# Altium schematic sheet [6]_Debug.SchDoc
size A3; DocumentNumber: 6; SheetNumber: 6; SheetTotal: 9; PageSetup: Record=PageOptions|CenterHorizontal=True|CenterVertical=True|PrintScale=0.97|XCorrection=1.00|YCorrection=1.00|PrintKind=1|BorderSize=5000000|LeftOffset=0|BottomOffset=0|Orientation=2|PaperLength=2970|PaperWidth=2100|Scale=100|PaperSource=7|PrintQuality=600|MediaType=1|DitherType=10|PaperKind=A4|PrintScaleMode=1
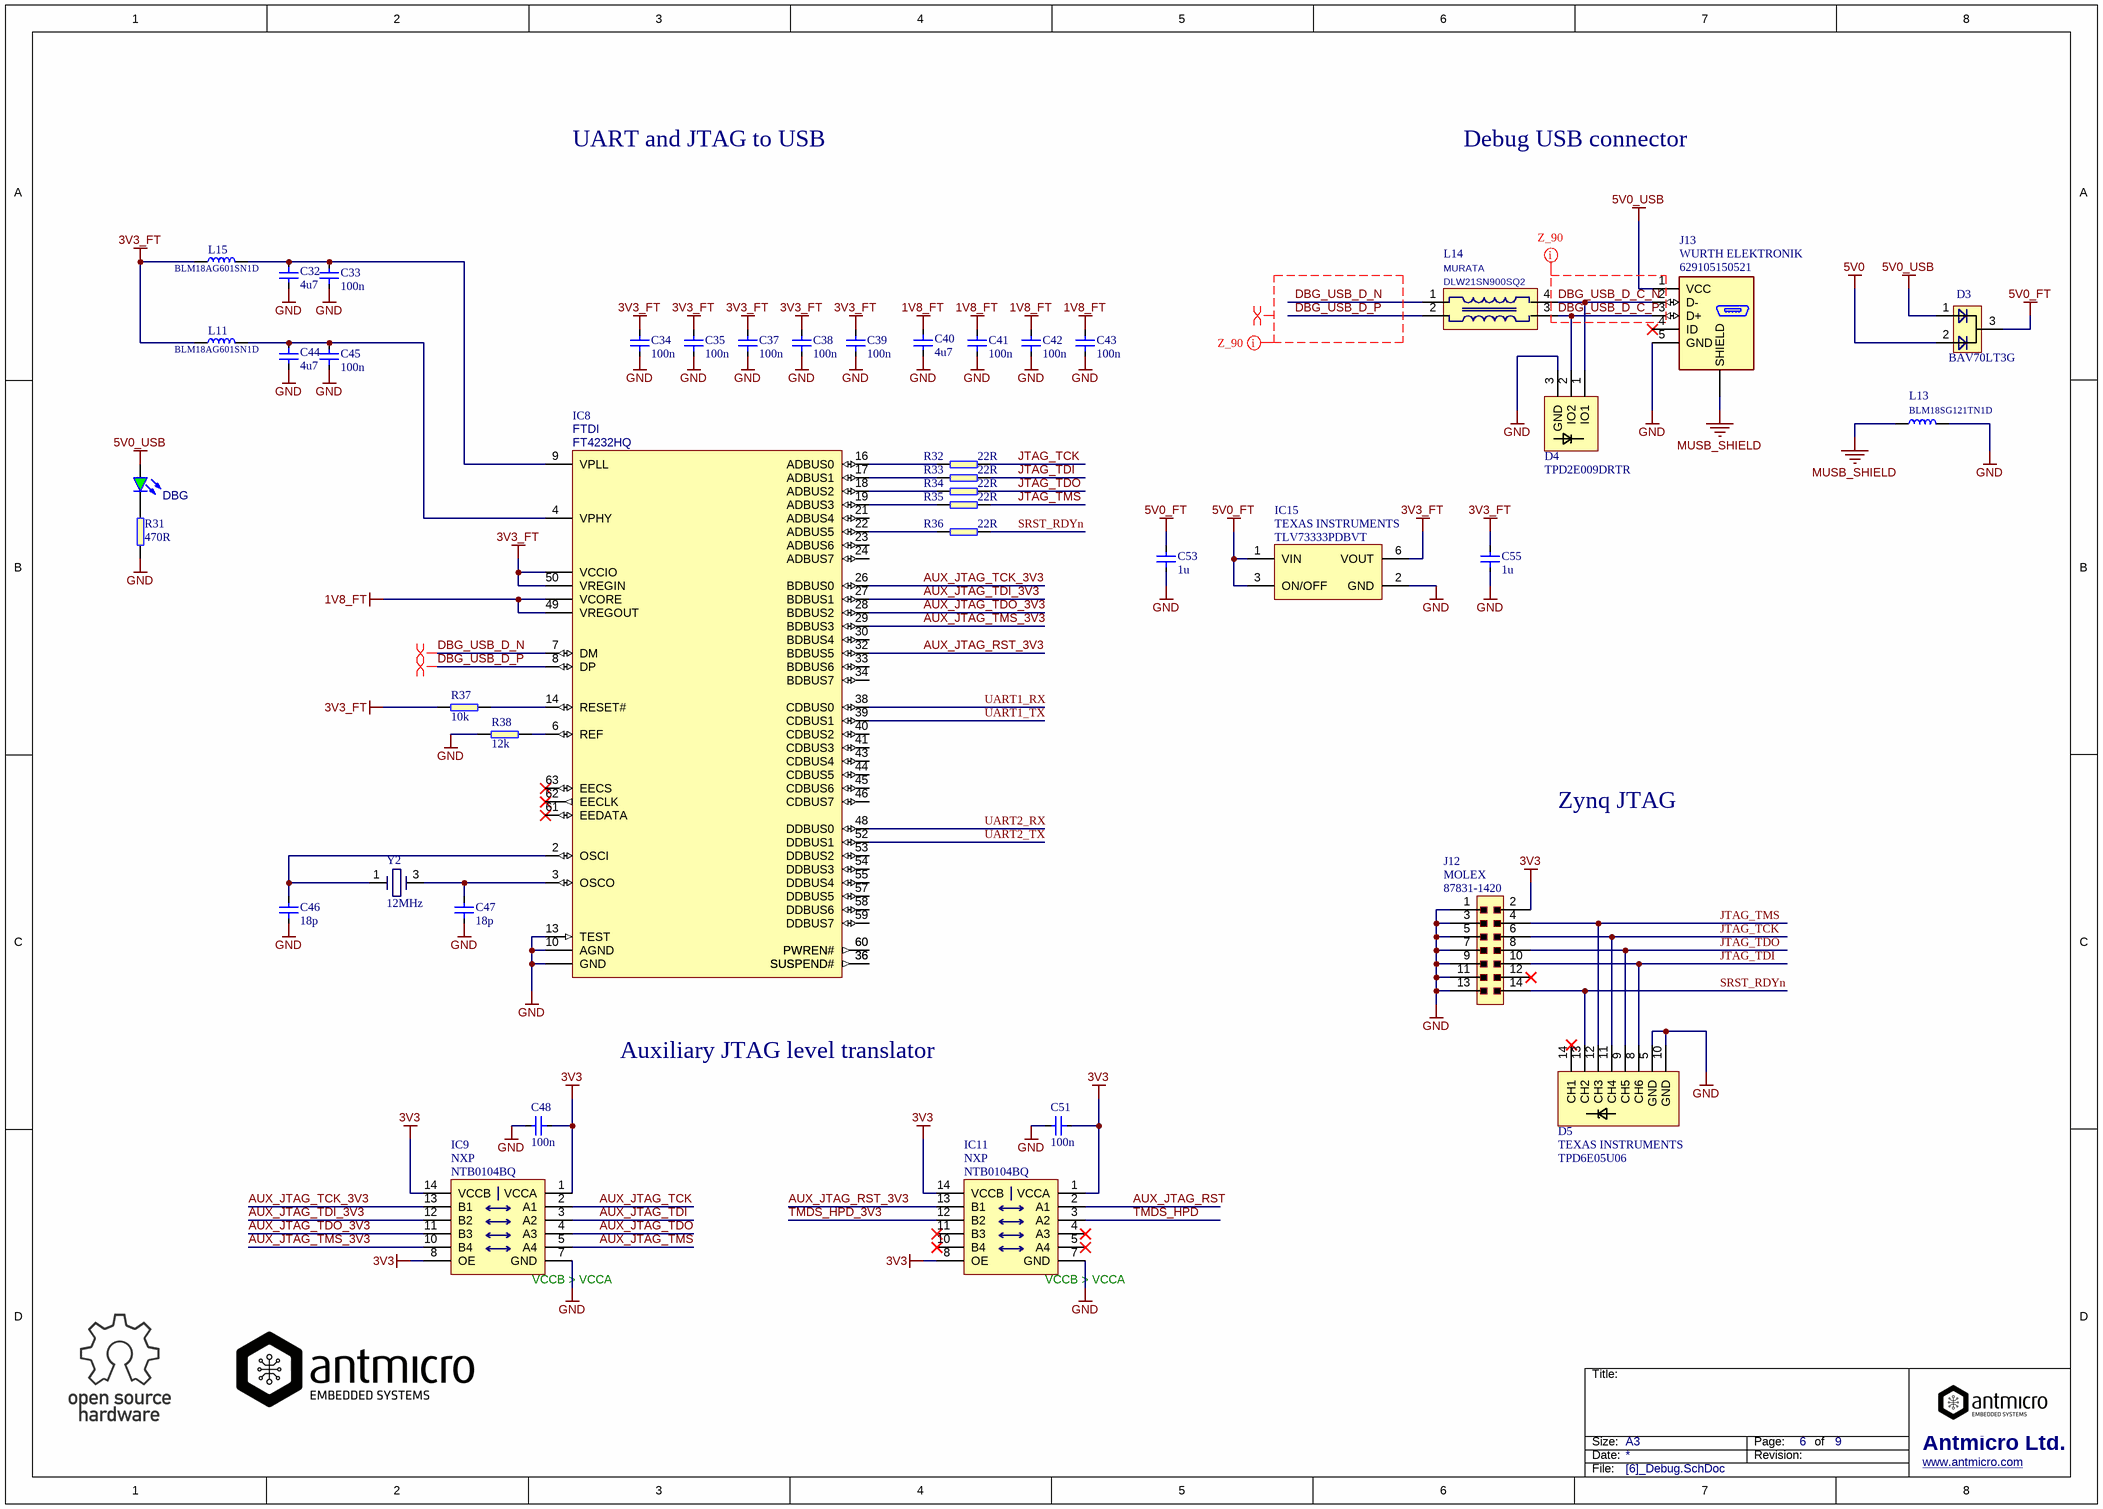
[diagram p0: [6]_Debug.SchDoc]

## Parts
C32  4u7  [0603]
C33  100n  [0402]
C34  100n  [0402]
C35  100n  [0402]
C37  100n  [0402]
C38  100n  [0402]
C39  100n  [0402]
C40  4u7  [0603]
C41  100n  [0402]
C42  100n  [0402]
C43  100n  [0402]
C44  4u7  [0603]
C45  100n  [0402]
C46  18p  [0402]
C47  18p  [0402]
C48  100n  [0402]
C51  100n  [0402]
C53  1u  [0603]
C55  1u  [0603]
D3  BAV70LT3G  [SOT-23]
D4  TPD2E009DRTR  [SOT-3]
D5  Manufacturer: TEXAS INSTRUMENTS  [TPD6E05U06_PASS]  (hidden comment: TPD6E05U06)
DBG  KPT-1608SGC  [LED0603]  (value not drawn)
IC8  Manufacturer: FTDI  [FT2232HQ]  (hidden comment: FT4232HQ)
IC9  Manufacturer: NXP  [DHVQFN14]  (hidden comment: NTB0104BQ)
IC11  Manufacturer: NXP  [DHVQFN14]  (hidden comment: NTB0104BQ)
IC15  TLV73333PDBVT  Manufacturer: TEXAS INSTRUMENTS  [SOT23-5N]
J12  Manufacturer: MOLEX  Part Symbol: 87831-1420  [CON-Molex-87831-1420]  (hidden comment: Molex-87831-1420)
J13  Manufacturer: WURTH ELEKTRONIK  Part Symbol: 629105150521  [WE_629105150521]
L11  BLM18AG601SN1D  [0603]
L13  BLM18SG121TN1D  [0603]
L14  Manufacturer: MURATA  [DLW21SN900SQ2]  (hidden comment: DLW21SN900SQ2)
L15  BLM18AG601SN1D  [0603]
R31  470R  [0402]
R32  22R  [0402]
R33  22R  [0402]
R34  22R  [0402]
R35  22R  [0402]
R36  22R  [0402]
R37  10k  [0402]
R38  12k  [0402]
Y2  12MHz  [QC3CA12]

## Nets
1V8_FT: C40.1 C41.2 C42.2 C43.2 IC8.49(VREGOUT) IC8.VCORE
3V3: C48.1 C51.1 IC9.1(VCCA) IC9.8(OE) IC9.14(VCCB) IC11.1(VCCA) IC11.8(OE) IC11.14(VCCB) J12.2
3V3_FT: C34.2 C35.2 C37.2 C38.2 C39.2 C55.2 IC8.50(VREGIN) IC8.VCCIO IC15.6(VOUT) L11.1 L15.1 R37.1
5V0: D3.2
5V0_FT: C53.2 D3.3 IC15.1(VIN) IC15.3(ON/OFF)
5V0_USB: D3.1 DBG.A J13.1(VCC)
GND: C32.2 C33.1 C34.1 C35.1 C37.1 C38.1 C39.1 C40.2 C41.1 C42.1 C43.1 C44.2 C45.1 C46.1 C47.1 C48.2 C51.2 C53.1 C55.1 D4.3(GND) D5.5(GND) D5.10(GND) IC8.10(AGND) IC8.13(TEST) IC8.GND IC9.7(GND) IC11.7(GND) IC15.2(GND) J12.1 J12.3 J12.5 J12.7 J12.9 J12.11 J12.13 J13.5(GND) L13.2 R31.1 R38.1 Y2.2 Y2.4
MUSB_SHIELD: J13.S(SHIELD) L13.1
AUX_JTAG_RST: IC11.2(A1)
AUX_JTAG_RST_3V3: IC8.32(BDBUS5) IC11.13(B1)
AUX_JTAG_TCK: IC9.2(A1)
AUX_JTAG_TCK_3V3: IC8.26(BDBUS0) IC9.13(B1)
AUX_JTAG_TDI: IC9.3(A2)
AUX_JTAG_TDI_3V3: IC8.27(BDBUS1) IC9.12(B2)
AUX_JTAG_TDO: IC9.4(A3)
AUX_JTAG_TDO_3V3: IC8.28(BDBUS2) IC9.11(B3)
AUX_JTAG_TMS: IC9.5(A4)
AUX_JTAG_TMS_3V3: IC8.29(BDBUS3) IC9.10(B4)
DBG_USB_D_C_N: D4.1(IO1) J13.2(D-) L14.4
DBG_USB_D_C_P: D4.2(IO2) J13.3(D+) L14.3
DBG_USB_D_N: IC8.7(DM) L14.1
DBG_USB_D_P: IC8.8(DP) L14.2
JTAG_TCK: D5.11(CH4) J12.6 R32.2
JTAG_TDI: D5.8(CH6) J12.10 R33.2
JTAG_TDO: D5.9(CH5) J12.8 R34.2
JTAG_TMS: D5.12(CH3) J12.4 R35.2
SRST_RDYn: D5.13(CH2) J12.14 R36.2
TMDS_HPD: IC11.3(A2)
TMDS_HPD_3V3: IC11.12(B2)
UART1_RX: IC8.38(CDBUS0)
UART1_TX: IC8.39(CDBUS1)
UART2_RX: IC8.48(DDBUS0)
UART2_TX: IC8.52(DDBUS1)
NetC32_1: C32.1 C33.2 IC8.9(VPLL) L15.2
NetC44_1: C44.1 C45.2 IC8.4(VPHY) L11.2
NetC46_2: C46.2 IC8.2(OSCI) Y2.1
NetC47_2: C47.2 IC8.3(OSCO) Y2.3
NetDBG_K: DBG.K R31.2
NetIC8_6: IC8.6(REF) R38.2
NetIC8_14: IC8.14(RESET#) R37.2
NetIC8_16: IC8.16(ADBUS0) R32.1
NetIC8_17: IC8.17(ADBUS1) R33.1
NetIC8_18: IC8.18(ADBUS2) R34.1
NetIC8_19: IC8.19(ADBUS3) R35.1
NetIC8_22: IC8.22(ADBUS5) R36.1

Not connected (* = marked no-connect by the designer): D5 14(CH1)*; IC8 21(ADBUS4) 23(ADBUS6) 24(ADBUS7) 30(BDBUS4) 33(BDBUS6) 34(BDBUS7) 36(SUSPEND#) 40(CDBUS2) 41(CDBUS3) 43(CDBUS4) 44(CDBUS5) 45(CDBUS6) 46(CDBUS7) 53(DDBUS2) 54(DDBUS3) 55(DDBUS4) 57(DDBUS5) 58(DDBUS6) 59(DDBUS7) 60(PWREN#) 61(EEDATA)* 62(EECLK)* 63(EECS)*; IC11 4(A3)* 5(A4)* 10(B4)* 11(B3)*; J12 12*; J13 4(ID)*

## Layout directives
differential pair: DBG_USB_D_N, DBG_USB_D_P
net class Z_90: DBG_USB_D_C_N, DBG_USB_D_C_P, DBG_USB_D_N, DBG_USB_D_P

## Notes on the sheet
- UART and JTAG to USB
- Debug USB connector
- Zynq JTAG
- Auxiliary JTAG level translator
- (near IC9) VCCB > VCCA
- (near IC11) VCCB > VCCA
- Title:
- Size:
- Date:
- A3
- Revision:
- Page:
- of
- Antmicro Ltd.
- File:
- www.antmicro.com

## Library data of the parts
C32 C40 C44 = C_4u7_0603: MLCC SMT Capacitor 4u7 0603; Manufacturer: MULTICOMP; Part Symbol: MC0603X475K6R3CT; Voltage: 6.3V; Part Number: C_4u7_0603; Value: 4u7
C33-C35 C37-C39 C41-C43 C45 C48 C51 = C_100n_0402: MLCC SMT Capacitor 100nF 0402; Manufacturer: MULTICOMP; Part Symbol: MC0402X104M100CT; Voltage: 10V; Tolerance: +-20%; Part Number: C_100n_0402; Value: 100n
C46 C47 = C_18p_0402: MLCC SMT Capacitor 18pF 0402; Manufacturer: KEMET; Part Symbol: C0402C180J5GACAUTO; Voltage: 50V; Tolerance: +-5%; Part Number: C_18p_0402; Value: 18p
C53 C55 = C_1u_0603: MLCC SMT Capacitor 1u 0603; Manufacturer: MULTICOMP; Part Symbol: MC0603X105M6R3CT; Voltage: 6.3V; Tolerance: +-20%; Part Number: C_1u_0603; Value: 1u
D3 = BAV70LT3G: Dual switching diode, common cathode; Manufacturer: ON SEMICONDUCTOR; Value: BAV70LT3G; Part Number: BAV70LT3G; Part Symbol: BAV70LT3G
D4 = TPD2E009: ESD Suppressors 2-CH; Manufacturer: TEXAS INSTRUMENTS; Part Number: TPD2E009DRTR; Value: TPD2E009DRTR; Part Symbol: TPD2E009DRTR
D5 = TPD6E05U06: ESD Suppressors 6-CH Pass through layout; Part Symbol: TPD6E05U06RVZR; Part Number: TPD6E05U06_PASS; Value: TPD6E05U06
DBG = LED: LED Green 0603 case; Part Number: LED_G; Manufacturer: KINGBRIGHT; Value: KPT-1608SGC; Part Symbol: KPT-1608SGC
IC8 = FT4232HQ: FTDI  FT4232HQ-R  Interface Bridges, USB to UART, MPSSE, 1.62 V, 1.98 V, QFN, 64 Pins, -40 °C; Part Number: FT4232HQ; Value: FT4232HQ; Part Symbol: FT4232HQ-R
IC9 IC11 = NTB0104BQ: 4 bit voltage level translator - no pullups; Part Number: NTB0104BQ; Value: NTB0104BQ; Part Symbol: NTB0104BQ
IC15 = TLV73333PDBVT: Capacitor-Free, 300-mA, Low-Dropout Regulator with Foldback Current Limit for Portable Devices; Part Symbol: TLV73328PDBVT; Part Number: TLV73333PDBVT; Value: TLV73333PDBVT
J12 = CON-Molex-87831-1420: HEADER, SQUARE PIN, M/GRID, 14WAY; Part Number: CON-Molex-87831-1420; Value: Molex-87831-1420
J13 = Micro USB B: Part Number: WE_629105150521
L11 L15 = BLM18AG601SN1D: FERRITE BEAD, 0.38OHM, 0.5, 0603; Manufacturer: MURATA; Part Symbol: BLM18SG121TN1D; Part Number: BLM18AG601SN1D; Value: BLM18AG601SN1D
L13 = BLM18SG121TN1D: FERRITE BEAD, 0.025OHM, 3A, 0603; Manufacturer: MURATA; Part Number: BLM18SG121TN1D; Value: BLM18SG121TN1D; Part Symbol: BLM18SG121TN1D
L14 = DLW21SN900SQ2: Common mode choke; Part Symbol: DLW21SN900SQ2L; Part Number: DLW21SN900SQ2; Value: DLW21SN900SQ2
R31 = R_470R_0402: SMT Resistor 470R 0402; Manufacturer: VISHAY; Part Symbol: CRCW0402470RFKED; Tolerance: 1%; Value: 470R; Part Number: R_470R_0402
R32-R36 = R_22R_0402: SMT Resistor 22R 0402; Manufacturer: VISHAY; Part Symbol: CRCW040222R0FKED; Tolerance: 1%; Part Number: R_22R_0402; Value: 22R
R37 = R_10k_0402: SMT Resistor 10k 0402; Manufacturer: MULTICOMP; Part Symbol: MCMR04X1002FTL; Tolerance: 1%; Part Number: R_10k_0402; Value: 10k
R38 = R_12k_0402: SMT Resistor 12k 0402; Manufacturer: VISHAY; Part Symbol: CRCW040212K0FKEDHP; Tolerance: 1%; Part Number: R_12k_0402; Value: 12k
Y2 = CRYSTAL_SMD_12Mhz: Crystal, 12 MHz, SMD, 3.2mm x 2.5mm, 30 ppm, 12 pF; Part Number: CRYSTAL_12MHz_3.2mm x2.5mm; Manufacturer: QANTEK TECHNOLOGY CORPORATION; Part Symbol: QC3CA12.0000F12B23M; Value: 12MHz